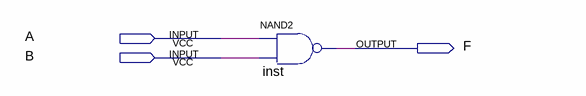
[diagram p0: schematic sheet]
// Quartus schematic and_not_Gate.bdf as structural Verilog: 1 symbols, 3 pins
module and_not_Gate (
  input  A,
  input  B,
  output F
);

  nand inst (F, A, B);
endmodule
